# Altium schematic sheet Main.SchDoc
size A; SheetNumber: 1; SheetTotal: 1
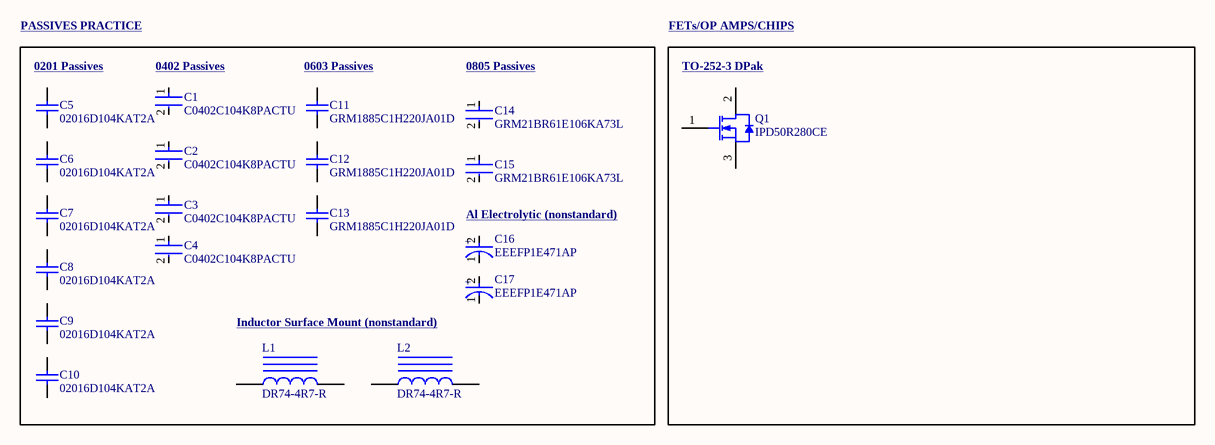
[diagram p0: Main.SchDoc]

## Parts
C1  C0402C104K8PACTU  [FP-C0402-BB-MFG]
C2  C0402C104K8PACTU  [FP-C0402-BB-MFG]
C3  C0402C104K8PACTU  [FP-C0402-BB-MFG]
C4  C0402C104K8PACTU  [FP-C0402-BB-MFG]
C5  02016D104KAT2A  [CAPC0603X33X15LL03T05]
C6  02016D104KAT2A  [CAPC0603X33X15LL03T05]
C7  02016D104KAT2A  [CAPC0603X33X15LL03T05]
C8  02016D104KAT2A  [CAPC0603X33X15LL03T05]
C9  02016D104KAT2A  [CAPC0603X33X15LL03T05]
C10  02016D104KAT2A  [CAPC0603X33X15LL03T05]
C11  GRM1885C1H220JA01D  [CAPC1608X90X35ML10T15]
C12  GRM1885C1H220JA01D  [CAPC1608X90X35ML10T15]
C13  GRM1885C1H220JA01D  [CAPC1608X90X35ML10T15]
C14  GRM21BR61E106KA73L  [FP-GRM21B-0_15-IPC_C]
C15  GRM21BR61E106KA73L  [FP-GRM21B-0_15-IPC_C]
C16  EEEFP1E471AP  [FP-FPG-MFG]
C17  EEEFP1E471AP  [FP-FPG-MFG]
L1  DR74-4R7-R  [COBU-DR74-4R7-R_V]
L2  DR74-4R7-R  [COBU-DR74-4R7-R_V]
Q1  IPD50R280CE  [INF-PG-TO252-3-313_N]

## Nets

Not connected (* = marked no-connect by the designer): C1 1 2; C2 1 2; C3 1 2; C4 1 2; C5 1 2; C6 1 2; C7 1 2; C8 1 2; C9 1 2; C10 1 2; C11 1 2; C12 1 2; C13 1 2; C14 1 2; C15 1 2; C16 1(C) 2(A); C17 1(C) 2(A); L1 1 2; L2 1 2; Q1 1(GATE) 2(DRAIN) 3(SOURCE)

## Notes on the sheet
- PASSIVES PRACTICE
- (near C5) 0201 Passives
- (near C1) 0402 Passives
- (near C11) 0603 Passives
- (near C14) 0805 Passives
- FETs/OP AMPS/CHIPS
- (near Q1) TO-252-3 DPak
- Al Electrolytic (nonstandard)
- Inductor Surface Mount (nonstandard)
- (in symbol CMP-2000-06214-2) +

## Library data of the parts
C1-C4 = CMP-2008-02046-2: CAP CER 0.1UF 10V X5R 0402; Manufacturer: Kemet; Material: Ceramic; Capacitance: 0.10 μF; Temperature Coefficient: 15%; Description: C0402 0.10 μF X5R 10.00% 10 V; Tolerance: 0.1; Value: 0.10 μF; Package: C0402-BB; Temperature: -55°C to +125°C; ComponentLink2Description: Datasheet; Temperature Characteristic: X5R; Device Class L1: Passive Components; Height: 0.55mm; Lead Free: Yes; ComponentLink2URL: https://content.kemet.com/datasheets/KEM_C1002_X7R_SMD.pdf; Device Class L2: Capacitors; Temperature Range Low: -55°C; Temperature Range High: +125°C; RoHS: TRUE; Octopart: https://octopart.com/c0402c104k8pactu-kemet-140039; Automotive: No; Mouser Description: Capacitor 100 nF 10 VDC 0402; Category: Cap; Voltage Rating: 10 V; Digikey Description: CAP CER 0.1UF 10V X5R 0402; Ipc Land Pattern Name: CAPC10050X50; Device Class L3: Ceramic Capacitors; Manufacturer Part Number: C0402C104K8PACTU
C5-C10 = CMP-2010-00159-1: Manufacturer: AVX Interconnect / Elco; Part Number: 02016D104KAT2A
C11-C13 = CMP-2000-04945-1: Chip Capacitor, 22 pF, +/- 5%, 50 V, -55 to 125 degC, 0603 (1608 Metric), RoHS, Tape and Reel; Manufacturer: Murata; Capacitance: 22pF; Rated Voltage: 50V; Dielectric: C0G; Manufacturer URL: http://www.murata.com/; Datasheet Version: Jul-06; Package Reference: 603; Tolerance (%): ±5%; Case Size/Dimension: 0603; Package Description: 2-Pin Surface Mount Device, Body 1.6 x 0.8 mm; Datasheet URL: https://datasheet.ciiva.com/11786/0900766b807a1cab-11786398.pdf
C14 C15 = CMP-2007-03541-2: Chip Multilayer Ceramic Capacitors for General Purpose, 0805, 10uF, X5R, 15%, 10%, 25V; Length: 2mm; Depth: 1.25mm; Termination: SMD/SMT; Voltage: 25V; Height: 1.25mm; Material: Ceramic; Thickness: 0.053inch; Radiation Hardening: No; Min Operating Temperature: -55°C; Width: 0.049inch; Package Quantity: 1; Mount: Surface Mount; Dielectric: X5R; Packaging: Tape and Reel; Capacitance: 10uF; Voltage Rating (DC): 25V; Lead Free: Lead Free; Max Operating Temperature: 85°C; Case Code (Imperial): 0805; Case/Package: 0805; Tolerance: 10%; Voltage Rating: 25V; Case Code (Metric): 2012
C16 C17 = CMP-2000-06214-2: CAP ALUM 470UF 20% 25V SMD; Ripple Current (AC): 1.19A; Polarity: Polar; ESR (Equivalent Series Resistance): 60mR; Material: Aluminium; Life (Hours): 2000Hour; Leakage Current: 117.5uA; Series: FP; Mount: Surface Mount; Min Operating Temperature: -55°C; Height - Seated (Max): 0.402inch; Voltage: 25V; Voltage Rating (DC): 25V; REACH SVHC: No SVHC; Lead Free: Lead Free; Length: 10.5mm; Radiation Hardening: No; Height: 10.2mm; Construction: Cylindrical; Voltage Rating: 25V; Case/Package: Radial; Termination: SMD/SMT; Lead Pitch: 4.6mm; Width: 10.3mm; Capacitance: 470uF; Package Quantity: 500; Ripple Current: 1.19A; RoHS Compliant: Yes; Tolerance: 20%; Contact Plating: Tin; Max Operating Temperature: 105°C; Packaging: Tape and Reel; Diameter: 10mm; Number of Pins: 2
L1 L2 = CMP-2000-06180-1: High Power Density, High Efficiency, Shielded Inductor, 4.7 uH, -40 to 125 degC, RoHS, Tape and Reel; Manufacturer: Eaton; Tolerance: ±20%; Current - Saturation: 4.37A; Type: Wirewound; Frequency - Test: 100kHz; Current Rating: 3.34A; DC Resistance (DCR): 25.4mOhm; Inductance: 4.7µH; Material - Core: Ferrite; Package Reference: DR74-4R7-R; Ratings: -; Frequency - Self Resonant: -; Operating Temperature: -40°C~125°C; Family: FixedInductors; Package / Case: Nonstandard; Mounting Type: SurfaceMount; Series: DR; Q @ Freq: -; Datasheet Version: 12/2012; Package Description: 2-Pin Surface Mount Device, Body 7.6 x 7.6 mm; Height - Seated (Max): 0.171"(4.35mm); Datasheet URL: https://datasheet.ciiva.com/14667/0900766b8116a153-14667792.pdf; Packaging: Tape&amp;Reel(TR); Manufacturer URL: http://www.cooperindustries.com/content/public/en/bussmann/electronics.html; Mounting Technology: SurfaceMount; Size / Dimension: 0.299"Lx0.299"W(7.60mmx7.60mm); Category: Inductors,Coils,Chokes; Shielding: Shielded
Q1 = CMP-1164-00347-1: N-Channel CoolMOS CE Power-Transistor, 500 V VDS, 13 A ID, -55 to 150 degC, PG-TO252-3-313, Reel, Green; Manufacturer: Infineon; Ptot (max): 92Â W; IDpuls (max): 42.9Â A; Rth: 1.36Â K/W; VGS(th) (max): 3.5Â V; RthJA (max): 62Â K/W; Green: TRUE; VDS (max): 500Â V; Polarity: N; QG: 32.6Â nC; ID (max): 13Â A; RDS (on) (max): 280Â mOhm; VGS(th) (min): 2.5Â V; PackageVersion: Oct-10; ComponentLink2Description: Datasheet; PackageReference: PG-TO252-3-313; Packing: Reel; RthJC (max): 1.36Â K/W; PackageDescription: 3-Pin Plastic (Green) Transistor Single Outline Package, 6.5 x 6.12 mm Body, 2.28 mm Pitch; ComponentLink1Description: Manufacturer URL; Mounting Technology: Surface Mount; ComponentLink3URL: http://www.infineon.com/dgdl/PG-TO252-3-313-Package_Overview.pdf?folderId=db3a30432b57a660012b81890ade72d2&fileId=db3a30432b57a660012b8193af2872eb; ComponentLink2URL: http://www.infineon.com/dgdl/IPD50R280CE+2.0.pdf?folderId=db3a3043156fd5730115c736bcc70ff2&fileId=db3a3043382e8373013850fd9c9b0fae; PartNumber: IPD50R280CE; ComponentLink1URL: http://www.infineon.com/; ComponentLink3Description: Package Specification; Technology: CoolMOS CE; DatasheetVersion: Rev. 2.0